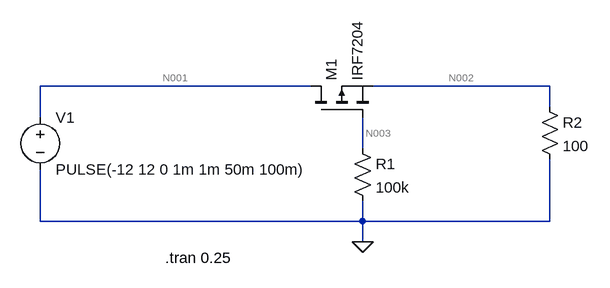
[diagram p0: schematic Verpolschutz_DC_12V.asc]
Verpolschutz_DC_12V.asc, the LTspice schematic file:
Version 4
SHEET 1 880 680
WIRE 192 144 -224 144
WIRE 560 144 288 144
WIRE 560 176 560 144
WIRE -224 192 -224 144
WIRE 272 240 272 192
WIRE -224 352 -224 272
WIRE 272 352 272 320
WIRE 272 352 -224 352
WIRE 560 352 560 256
WIRE 560 352 272 352
WIRE 272 384 272 352
FLAG 272 384 0
SYMBOL pmos 192 192 R270
SYMATTR InstName M1
SYMATTR Value IRF7204
SYMBOL res 256 224 R0
SYMATTR InstName R1
SYMATTR Value 100k
SYMBOL res 544 160 R0
SYMATTR InstName R2
SYMATTR Value 100
SYMBOL voltage -224 176 R0
WINDOW 123 0 0 Left 2
WINDOW 39 0 0 Left 2
SYMATTR InstName V1
SYMATTR Value PULSE(-12 12 0 1m 1m 50m 100m)
TEXT -32 408 Left 2 !.tran 0.25

The netlist it stands for:
* Verpolschutz_DC_12V.asc
M1 N001 N003 N002 N002 IRF7204
R1 N003 0 100k
R2 N002 0 100
V1 N001 0 PULSE(-12 12 0 1m 1m 50m 100m)
.model NMOS NMOS
.model PMOS PMOS
.lib standard.mos
.tran 0.25
.backanno
.end

* Results of the author's LTspice run, read from the files saved beside the schematic
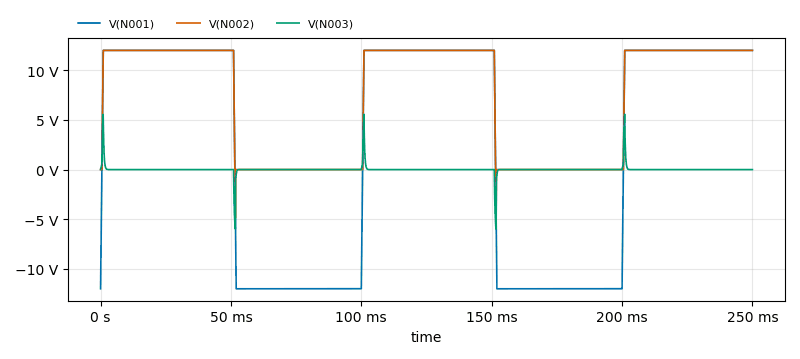
[diagram p1: Transient Analysis of Verpolschutz_DC_12V.asc, plotted from the saved traces]
* Transient Analysis, 1 run:
*   V(N001): min -12 V, max 12 V, average 2.544 V, rms 11.92 V, last 12 V
*   V(N002): min -4.883 V, max 11.99 V, average 7.202 V, rms 9.287 V, last 11.99 V
*   V(N003): min -5.984 V, max 5.571 V, average 15.48 mV, rms 521.5 mV, last 0 V